# Altium project TP_LCD.PrjPCB
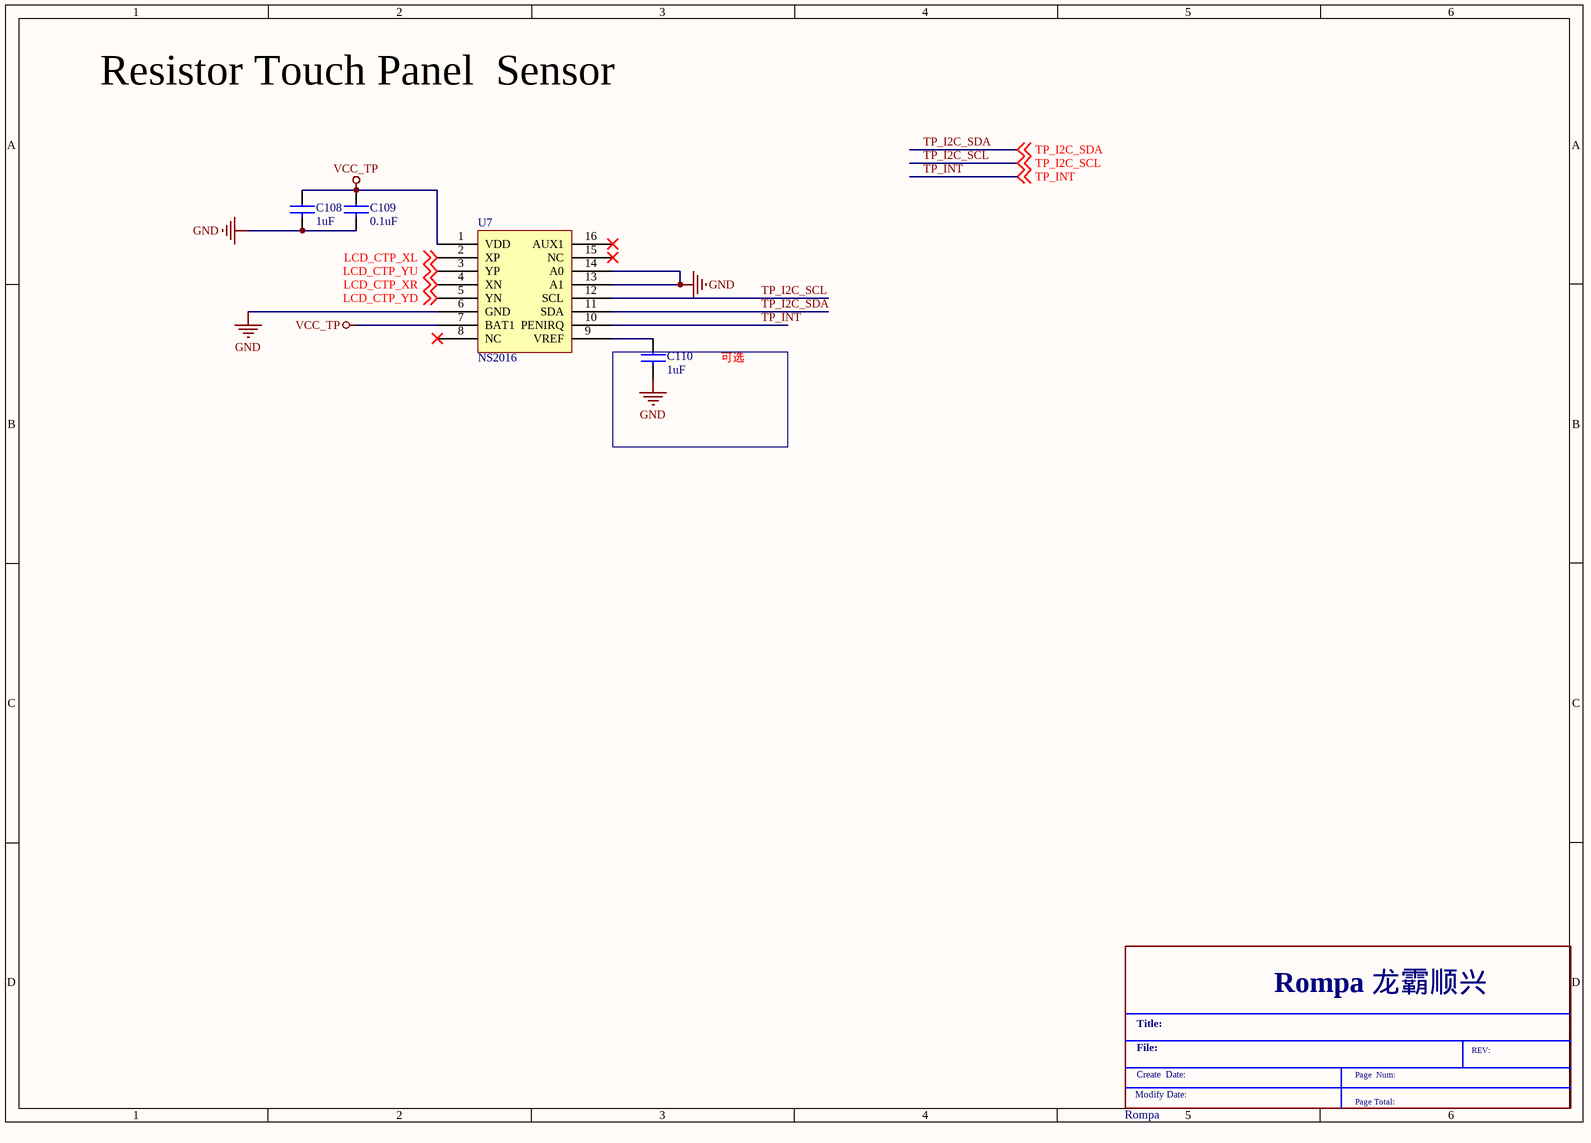
[diagram p0: Option_CTP.SchDoc]
2 sheets, 26 parts. Net scope: global (net labels, ports and power ports of the same name join across sheets).
Sheets:
  Option_CTP.SchDoc
  Option_lcd.SchDoc

## Sheet Option_CTP.SchDoc
size 297 x 209 mm

### Parts
(Parts that share a designator on the sheet are numbered #1, #2 ... from top to bottom, then left to right.)
*#1  Rompa  (graphical)
C108  1uF  [C0402]
C109  0.1uF  [C0402]
C110  1uF  [C0402]
U7  NS2016  [SSOP16]

### Blocks framed on the sheet
可选: C110

### Nets
GND: C108.2 C109.2 C110.2 U7.6(GND) U7.13(A1) U7.14(A0)
VCC_TP: C108.1 C109.1 U7.1(VDD) U7.7(BAT1)
LCD_CTP_XL: U7.2(XP) ; off-sheet LCD_CTP_XL
LCD_CTP_XR: U7.4(XN) ; off-sheet LCD_CTP_XR
LCD_CTP_YD: U7.5(YN) ; off-sheet LCD_CTP_YD
LCD_CTP_YU: U7.3(YP) ; off-sheet LCD_CTP_YU
TP_I2C_SCL: U7.12(SCL) ; off-sheet TP_I2C_SCL
TP_I2C_SDA: U7.11(SDA) ; off-sheet TP_I2C_SDA
TP_INT: U7.10(PENIRQ) ; off-sheet TP_INT
NetC110_1: C110.1 U7.9(VREF)

Not connected (* = marked no-connect by the designer): U7 8(NC)* 15(NC)* 16(AUX1)*

### Notes on the sheet
- Resistor Touch Panel  Sensor
- (in symbol Rompa) Rompa 龙霸顺兴; Title:; File:; REV:; Create  Date:; Page  Num:; Modify Date:; Page Total:

### Library data of the parts
C108-C110 = CAP NP
U7 = NS2016: TSSOP-16

## Sheet Option_lcd.SchDoc
size 297 x 209 mm
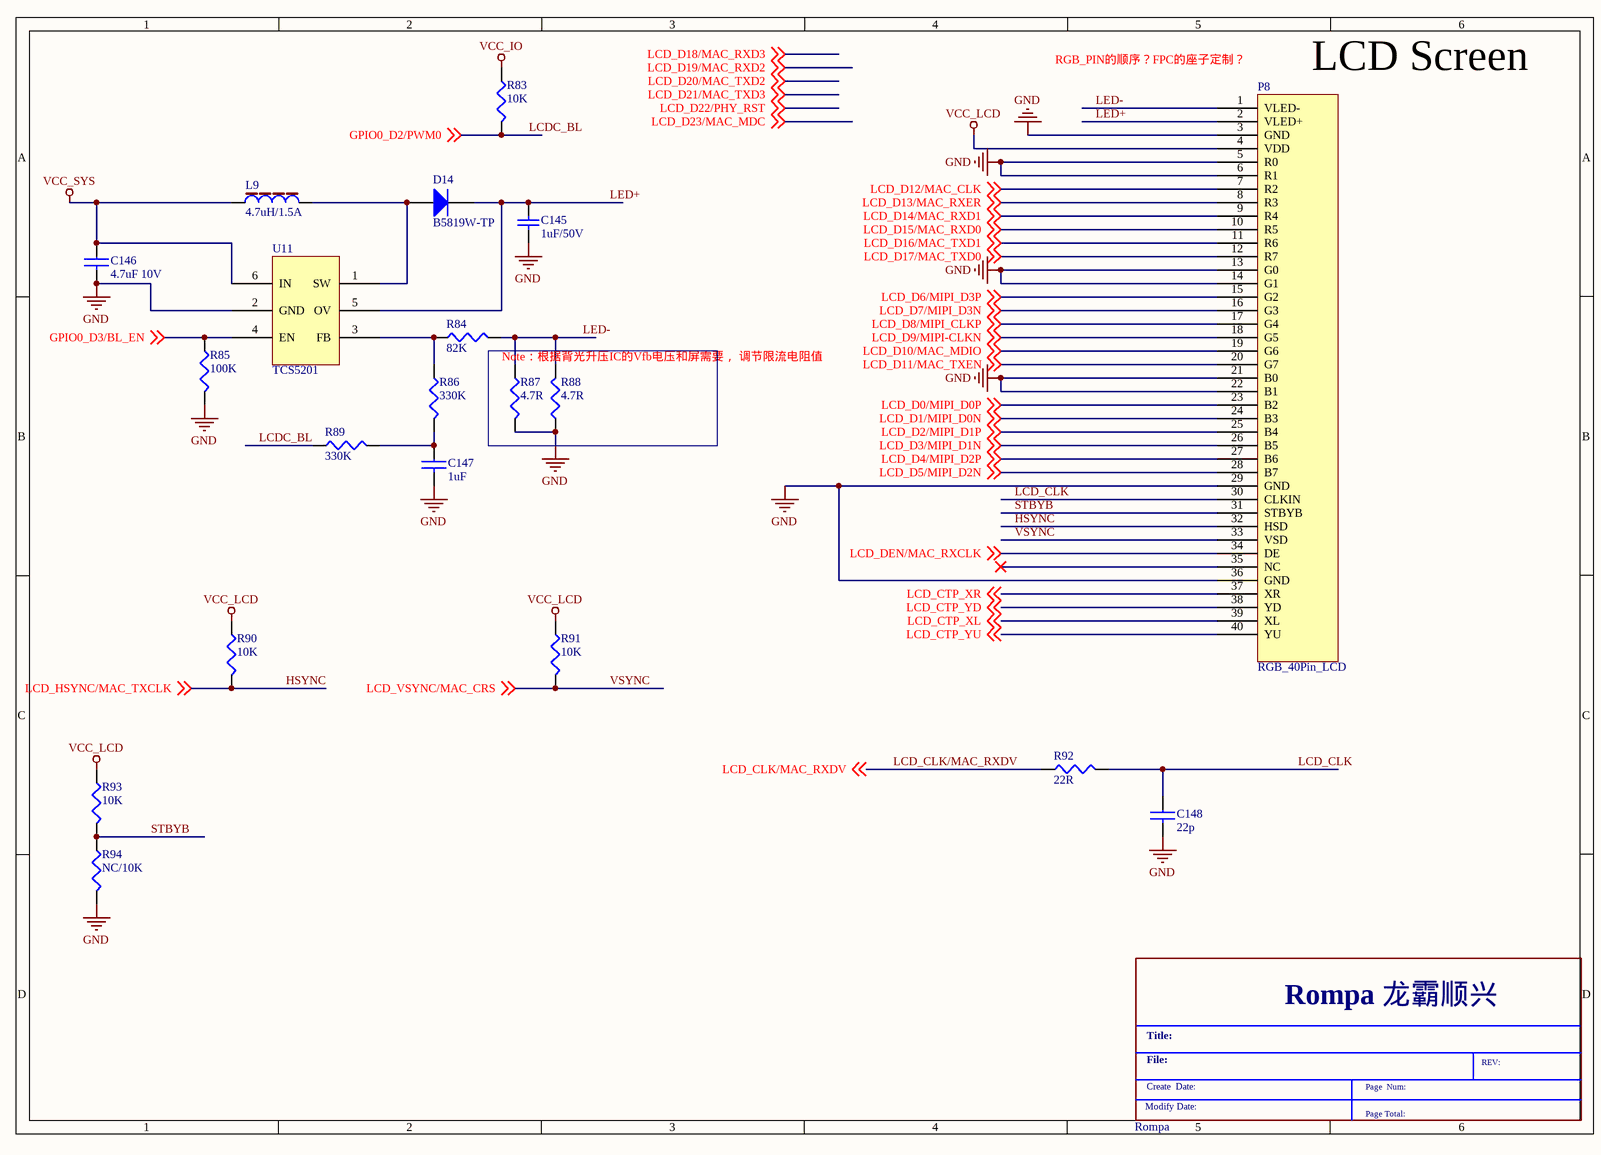
[diagram p1: Option_lcd.SchDoc]

### Parts
(Parts that share a designator on the sheet are numbered #1, #2 ... from top to bottom, then left to right.)
*#2  Rompa  (graphical)
C145  1uF/50V  [2012[0805]]
C146  4.7uF 10V  [C0603]
C147  1uF  [C0805]
C148  22p  [C0402]
D14  B5819W-TP
L9  4.7uH/1.5A
P8  RGB_40Pin_LCD
R83  10K  [R0402]
R84  82K  [R0402]
R85  100K  [R0402]
R86  330K  [R0402]
R87  4.7R  [1608[0603]]
R88  4.7R  [1608[0603]]
R89  330K  [R0402]
R90  10K  [R0402]
R91  10K  [R0402]
R92  22R  [R0402]
R93  10K  [R0402]
R94  NC/10K  [R0402]
U11  TCS5201

### Blocks framed on the sheet
Note：根据背光升压IC的Vfb电压和屏需要， 调节限流电阻值: R87 R88

### Nets
GND: C145.1 C146.2 C147.2 C148.2 P8.3(GND) P8.5(R0) P8.6(R1) P8.13(G0) P8.14(G1) P8.21(B0) P8.22(B1) P8.29(GND) P8.36(GND) R85.2 R87.2 R88.1 R94.2 U11.2(GND)
VCC_IO: R83.1
VCC_LCD: P8.4(VDD) R90.1 R91.1 R93.1
VCC_SYS: C146.1 L9.1 U11.6(IN)
GPIO0_D3/BL_EN: R85.1 U11.4(EN) ; off-sheet GPIO0_D3/BL_EN
HSYNC: P8.32(HSD) R90.2 ; off-sheet LCD_HSYNC/MAC_TXCLK  [also labelled LCD_HSYNC/MAC_TXCLK]
LCD_CLK: C148.1 P8.30(CLKIN) R92.2
LCD_CLK/MAC_RXDV: R92.1 ; off-sheet LCD_CLK/MAC_RXDV
LCD_CTP_XL: P8.39(XL) ; off-sheet LCD_CTP_XL
LCD_CTP_XR: P8.37(XR) ; off-sheet LCD_CTP_XR
LCD_CTP_YD: P8.38(YD) ; off-sheet LCD_CTP_YD
LCD_CTP_YU: P8.40(YU) ; off-sheet LCD_CTP_YU
LCD_D0/MIPI_D0P: P8.23(B2) ; off-sheet LCD_D0/MIPI_D0P
LCD_D1/MIPI_D0N: P8.24(B3) ; off-sheet LCD_D1/MIPI_D0N
LCD_D2/MIPI_D1P: P8.25(B4) ; off-sheet LCD_D2/MIPI_D1P
LCD_D3/MIPI_D1N: P8.26(B5) ; off-sheet LCD_D3/MIPI_D1N
LCD_D4/MIPI_D2P: P8.27(B6) ; off-sheet LCD_D4/MIPI_D2P
LCD_D5/MIPI_D2N: P8.28(B7) ; off-sheet LCD_D5/MIPI_D2N
LCD_D6/MIPI_D3P: P8.15(G2) ; off-sheet LCD_D6/MIPI_D3P
LCD_D7/MIPI_D3N: P8.16(G3) ; off-sheet LCD_D7/MIPI_D3N
LCD_D8/MIPI_CLKP: P8.17(G4) ; off-sheet LCD_D8/MIPI_CLKP
LCD_D9/MIPI-CLKN: P8.18(G5) ; off-sheet LCD_D9/MIPI-CLKN
LCD_D10/MAC_MDIO: P8.19(G6) ; off-sheet LCD_D10/MAC_MDIO
LCD_D11/MAC_TXEN: P8.20(G7) ; off-sheet LCD_D11/MAC_TXEN
LCD_D12/MAC_CLK: P8.7(R2) ; off-sheet LCD_D12/MAC_CLK
LCD_D13/MAC_RXER: P8.8(R3) ; off-sheet LCD_D13/MAC_RXER
LCD_D14/MAC_RXD1: P8.9(R4) ; off-sheet LCD_D14/MAC_RXD1
LCD_D15/MAC_RXD0: P8.10(R5) ; off-sheet LCD_D15/MAC_RXD0
LCD_D16/MAC_TXD1: P8.11(R6) ; off-sheet LCD_D16/MAC_TXD1
LCD_D17/MAC_TXD0: P8.12(R7) ; off-sheet LCD_D17/MAC_TXD0
LCD_DEN/MAC_RXCLK: P8.34(DE) ; off-sheet LCD_DEN/MAC_RXCLK
LCDC_BL: R83.2 R89.1 ; off-sheet GPIO0_D2/PWM0  [also labelled GPIO0_D2/PWM0]
LED+: C145.2 D14.2(K) P8.2(VLED+) U11.5(OV)
LED-: P8.1(VLED-) R84.2 R87.1 R88.2
STBYB: P8.31(STBYB) R93.2 R94.1
VSYNC: P8.33(VSD) R91.2 ; off-sheet LCD_VSYNC/MAC_CRS  [also labelled LCD_VSYNC/MAC_CRS]
NetC147_1: C147.1 R86.2 R89.2
NetD14_1: D14.1(A) L9.2 U11.1(SW)
NetR84_1: R84.1 R86.1 U11.3(FB)

Not connected (* = marked no-connect by the designer): P8 35(NC)*

### Notes on the sheet
- RGB_PIN的顺序？FPC的座子定制？
- LCD Screen
- (in symbol Rompa) Rompa 龙霸顺兴; Title:; File:; REV:; Create  Date:; Page  Num:; Modify Date:; Page Total:

### Library data of the parts
C145 = Cap: 1uF/50V,; Published: 8-Jun-2000; LatestRevisionDate: 17-Jul-2002; LatestRevisionNote: Re-released for DXP Platform.; PackageReference: RAD-0.3; Publisher: Altium Limited
C146 = CAP NP_Dup1
C147 C148 = CAP NP
D14 = Diode: Micro Commercial Co ,  SOD-123; Published: 8-Jun-2000; LatestRevisionDate: 17-Jul-2002; LatestRevisionNote: Re-released for DXP Platform.; PackageDocument: Sep-1996; PackageReference: SMC; Publisher: Altium Limited; Code_JEDEC: DO-214-AB
L9 = INDUCTOR_2: 4.7uH/1.5A , IND_4x4
P8 = RGB_40Pin_LCD: FPC的规格：0.5mm间距， 40PING，Pitch2.0mm, 翻盖式 下接
R83-R94 = RESISTOR
U11 = TCS5201: LED升压模块, STO26

## Nets that join several sheets
GND: Option_CTP (6 pins), Option_lcd (18 pins)
LCD_CTP_XL: Option_CTP (U7.2), Option_lcd (P8.39)
LCD_CTP_XR: Option_CTP (U7.4), Option_lcd (P8.37)
LCD_CTP_YD: Option_CTP (U7.5), Option_lcd (P8.38)
LCD_CTP_YU: Option_CTP (U7.3), Option_lcd (P8.40)